# Altium schematic sheet NB3000 The Dining Philosophers Problem.SchDoc
size A; DocumentNumber: 1; SheetNumber: 1; SheetTotal: 1
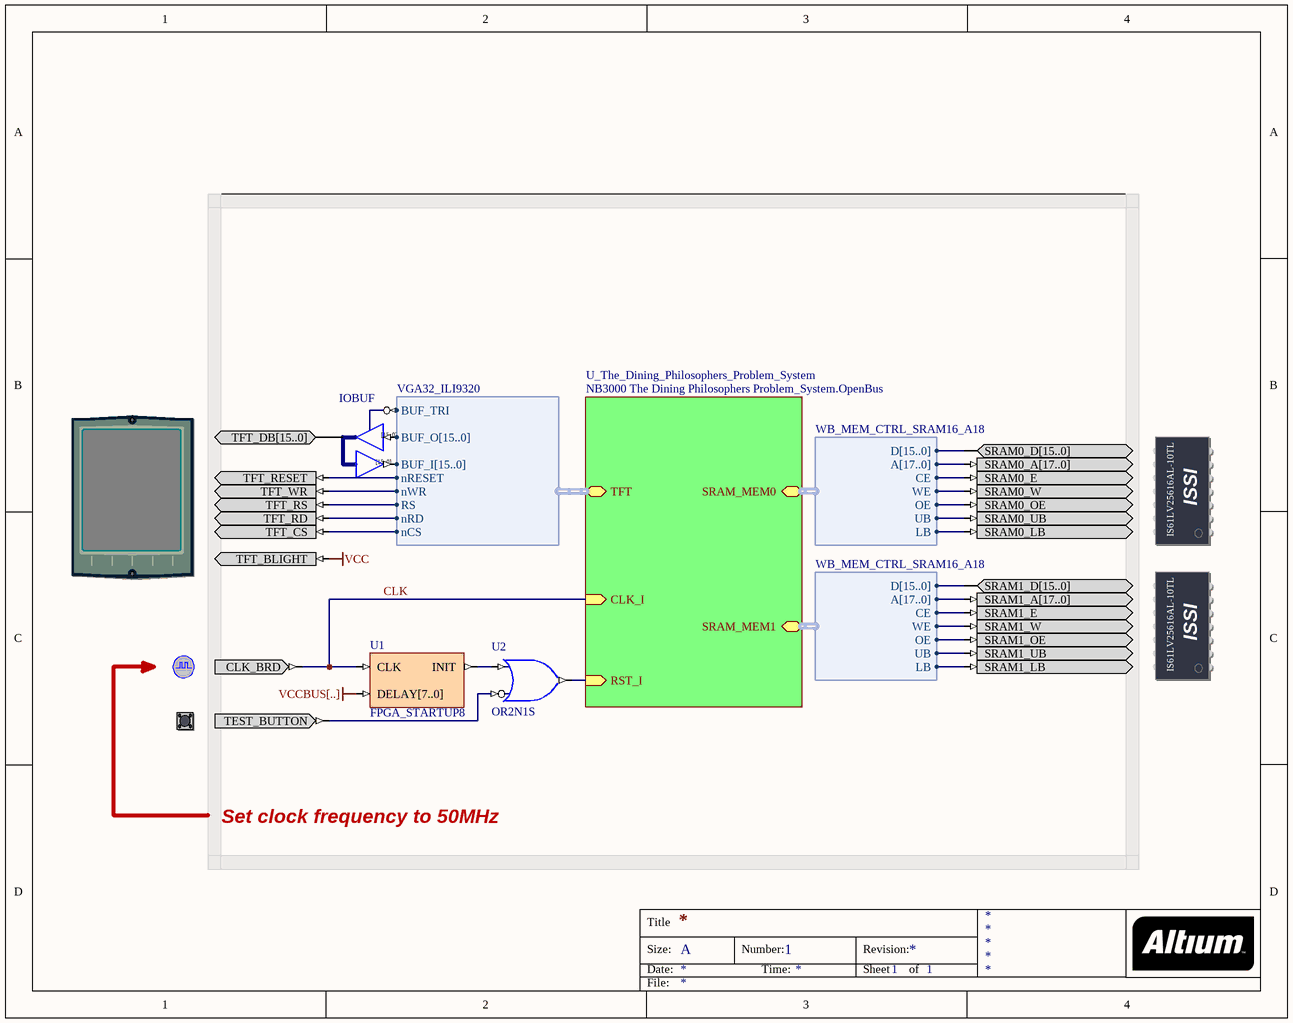
[diagram p0: NB3000 The Dining Philosophers Problem.SchDoc]

## Parts
(Parts that share a designator on the sheet are numbered #1, #2 ... from top to bottom, then left to right.)
?#1  TFT_LCD  (value not drawn)
?#2  SRAM0  (value not drawn)
?#3  SRAM1  (value not drawn)
?#4  CLOCK_BOARD  (value not drawn)
?#5  TEST_BUTTON  (value not drawn)
IOBUF  IOBUF16B  (value not drawn)
U1  FPGA_STARTUP8
U2  OR2N1S

## Blocks framed on the sheet
Set clock frequency to 50MHz: ?#1-?#5 IOBUF U1 U2

## Sub-sheets
U_The_Dining_Philosophers_Problem_System = NB3000 The Dining Philosophers Problem_System.OpenBus: SRAM_MEM0 (harness WB_MEM_CTRL_SRAM16_A18), SRAM_MEM1 (harness WB_MEM_CTRL_SRAM16_A18), TFT (harness VGA32_ILI9320), RST_I (in), CLK_I (in)

## Harnesses
VGA32_ILI9320: BUF_TRI, BUF_O[15..0], BUF_I[15..0], nRESET, nWR, RS, nRD, nCS
WB_MEM_CTRL_SRAM16_A18: D[15..0], A[17..0], CE, WE, OE, UB, LB

## Nets
VCC: ?#1.TFT_BLIGHT
VCCBUS[..]: U1.DELAY[7..0]
CLK: ?#4.CLK_BRD U1.CLK ; sheet U_The_Dining_Philosophers_Problem_System/CLK_I
Net?#1_TFT_CS: ?#1.TFT_CS ; sheet U_The_Dining_Philosophers_Problem_System/TFT.nCS
Net?#1_TFT_DB[15..0]: ?#1.TFT_DB[15..0] IOBUF.IO[15..0]
Net?#1_TFT_RD: ?#1.TFT_RD ; sheet U_The_Dining_Philosophers_Problem_System/TFT.nRD
Net?#1_TFT_RESET: ?#1.TFT_RESET ; sheet U_The_Dining_Philosophers_Problem_System/TFT.nRESET
Net?#1_TFT_RS: ?#1.TFT_RS ; sheet U_The_Dining_Philosophers_Problem_System/TFT.RS
Net?#1_TFT_WR: ?#1.TFT_WR ; sheet U_The_Dining_Philosophers_Problem_System/TFT.nWR
Net?#2_SRAM0_A[17..0]: ?#2.SRAM0_A[17..0] ; sheet U_The_Dining_Philosophers_Problem_System/SRAM_MEM0.A[17..0]
Net?#2_SRAM0_D[15..0]: ?#2.SRAM0_D[15..0] ; sheet U_The_Dining_Philosophers_Problem_System/SRAM_MEM0.D[15..0]
Net?#2_SRAM0_E: ?#2.SRAM0_E ; sheet U_The_Dining_Philosophers_Problem_System/SRAM_MEM0.CE
Net?#2_SRAM0_LB: ?#2.SRAM0_LB ; sheet U_The_Dining_Philosophers_Problem_System/SRAM_MEM0.LB
Net?#2_SRAM0_OE: ?#2.SRAM0_OE ; sheet U_The_Dining_Philosophers_Problem_System/SRAM_MEM0.OE
Net?#2_SRAM0_UB: ?#2.SRAM0_UB ; sheet U_The_Dining_Philosophers_Problem_System/SRAM_MEM0.UB
Net?#2_SRAM0_W: ?#2.SRAM0_W ; sheet U_The_Dining_Philosophers_Problem_System/SRAM_MEM0.WE
Net?#3_SRAM1_A[17..0]: ?#3.SRAM1_A[17..0] ; sheet U_The_Dining_Philosophers_Problem_System/SRAM_MEM1.A[17..0]
Net?#3_SRAM1_D[15..0]: ?#3.SRAM1_D[15..0] ; sheet U_The_Dining_Philosophers_Problem_System/SRAM_MEM1.D[15..0]
Net?#3_SRAM1_E: ?#3.SRAM1_E ; sheet U_The_Dining_Philosophers_Problem_System/SRAM_MEM1.CE
Net?#3_SRAM1_LB: ?#3.SRAM1_LB ; sheet U_The_Dining_Philosophers_Problem_System/SRAM_MEM1.LB
Net?#3_SRAM1_OE: ?#3.SRAM1_OE ; sheet U_The_Dining_Philosophers_Problem_System/SRAM_MEM1.OE
Net?#3_SRAM1_UB: ?#3.SRAM1_UB ; sheet U_The_Dining_Philosophers_Problem_System/SRAM_MEM1.UB
Net?#3_SRAM1_W: ?#3.SRAM1_W ; sheet U_The_Dining_Philosophers_Problem_System/SRAM_MEM1.WE
Net?#5_TEST_BUTTON: ?#5.TEST_BUTTON U2.I0
NetIOBUF_I[15..0]: IOBUF.I[15..0] ; sheet U_The_Dining_Philosophers_Problem_System/TFT.BUF_O[15..0]
NetIOBUF_O[15..0]: IOBUF.O[15..0] ; sheet U_The_Dining_Philosophers_Problem_System/TFT.BUF_I[15..0]
NetIOBUF_T: IOBUF.T ; sheet U_The_Dining_Philosophers_Problem_System/TFT.BUF_TRI
NetU1_INIT: U1.INIT U2.I1
NetU2_O: U2.O ; sheet U_The_Dining_Philosophers_Problem_System/RST_I

## Notes on the sheet
- Title
- Size:
- Date:
- A
- Number:
- Time:
- Revision:
- Sheet
- of
- File:
- (in symbol IOBUF16B) [15..0]
- (in symbol SRAM0) ISSI; IS61LV25616AL-10TL
- (in symbol SRAM1) ISSI; IS61LV25616AL-10TL

## Library data of the parts
?#1 = TFT_LCD: TFT LCD Panel; PortComponent: True; Published: 22-Jan-2007; Publisher: Altium Limited; HelpURL: https://wiki.altium.com/display/ADOH/NanoBoard+3000+-+TFT+LCD+Panel+%28with+Touch+Screen%29
?#2 = SRAM0: Free Static RAM - Daughterboard; PortComponent: True; Published: 14-May-2007; Publisher: Altium Limited; HelpURL: https://wiki.altium.com/display/ADOH/NanoBoard+3000+-+Independent+SRAM
?#3 = SRAM1: Free Static RAM - Daughterboard; PortComponent: True; Published: 14-May-2007; Publisher: Altium Limited; HelpURL: https://wiki.altium.com/display/ADOH/NanoBoard+3000+-+Independent+SRAM
?#4 = CLOCK_BOARD: Global System Clock Supply; PortComponent: True; Published: 19-Nov-2003; Publisher: Altium Limited; HelpURL: TR0143 Technical Reference Manual for Altium's Desktop NanoBoard NB2DSK01.pdf#page=41; UseInDSF: True
?#5 = TEST_BUTTON: Test / Reset Button; PortComponent: True; Published: 19-Nov-2003; Publisher: Altium Limited; HelpURL: TR0143 Technical Reference Manual for Altium's Desktop NanoBoard NB2DSK01.pdf#page=53
IOBUF = IOBUF16B: 16-Bit Input/Output Buffer, Bus Version; SubClass: IOBUF; Enable: Low; Control: Common Control T; PortSize: 16; ArchiveName: GENERIC; VHDLIB_SIM: GENERIC_LIB; Published: 29-Jan-2004; Publisher: Altium Limited; LastRevisionNo: 1.00.00; HelpURL: CR0118 FPGA Generic Library Guide.pdf#page=293; ComponentLink1URL: CR0125 FPGA Buffer Resource Usage.pdf#page=91; ComponentLink1Description: Core &Resource Usage; FunctionalClass: Buffer; PortStyle: Bus Version
U1 = FPGA_STARTUP8: FPGA Startup With 8 Bit Delay; Published: 9-Dec-2004; Publisher: Altium Limited; HelpURL: CR0119 FPGA_STARTUPx Powerup Delay Unit.pdf; LastRevisionNo: 1.00.00; ComponentLink1Description: Core &Resource Usage; ComponentLink1URL: CR0139 FPGA Peripheral Resource Usage.pdf#page=11
U2 = OR2N1S: 2-Input OR Gate with Active Low A Input, Single Pin Version; XilinxEquivalent: OR2B1; FunctionalClass: Logic Primitive; PortSize: 2; ArchiveName: GENERIC; VHDLIB_SIM: GENERIC_LIB; Published: 29-Jan-2004; Publisher: Altium Limited; LastRevisionNo: 1.00.00; HelpURL: CR0118 FPGA Generic Library Guide.pdf#page=410; ComponentLink1URL: CR0136 FPGA Logic Primitive Resource Usage.pdf#page=187; ComponentLink1Description: Core &Resource Usage; SubClass: OR; PortStyle: Single Pin Version